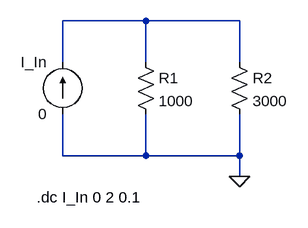
[diagram p0: schematic ELEN 115 Lab 1 Part 4.asc]
ELEN 115 Lab 1 Part 4.asc, the LTspice schematic file:
Version 4
SHEET 1 880 680
WIRE 208 80 80 80
WIRE 352 80 208 80
WIRE 80 144 80 80
WIRE 208 144 208 80
WIRE 352 144 352 80
WIRE 80 288 80 224
WIRE 208 288 208 224
WIRE 208 288 80 288
WIRE 352 288 352 224
WIRE 352 288 208 288
WIRE 352 320 352 288
FLAG 352 320 0
SYMBOL current 80 224 R180
WINDOW 0 24 80 Left 2
WINDOW 3 24 0 Left 2
SYMATTR InstName I_In
SYMATTR Value 0
SYMBOL res 192 128 R0
SYMATTR InstName R1
SYMATTR Value 1000
SYMBOL res 336 128 R0
SYMATTR InstName R2
SYMATTR Value 3000
TEXT 40 352 Left 2 !.dc I_In 0 2 0.1

The netlist it stands for:
* ELEN 115 Lab 1 Part 4.asc
I_In 0 N001 0
R1 N001 0 1000
R2 N001 0 3000
.dc I_In 0 2 0.1
.backanno
.end